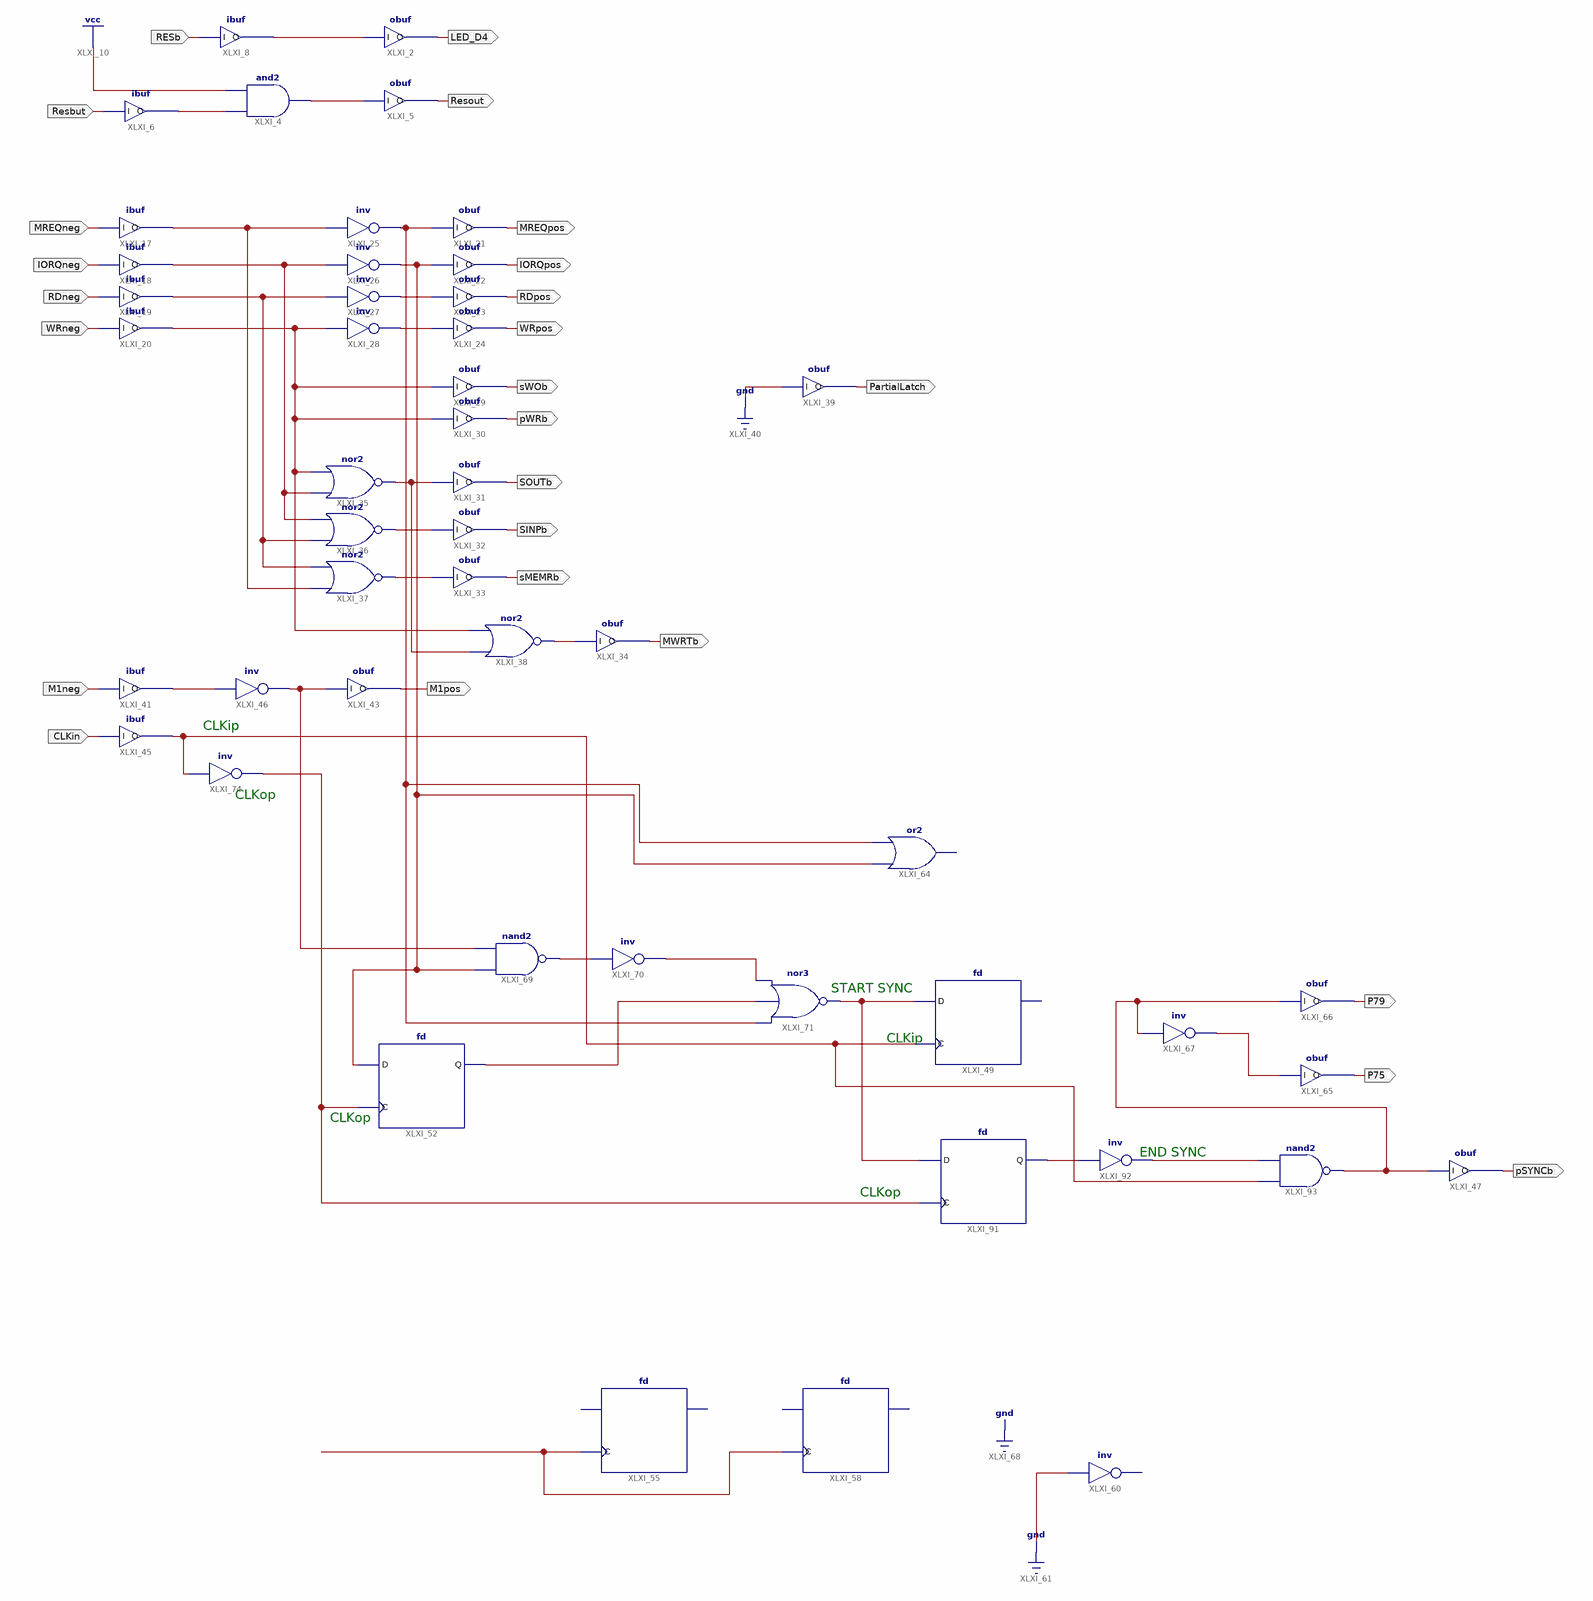
[diagram p0: schematic sheet 1]
// Xilinx ISE schematic IC1v2.sch (xc9500) as structural Verilog: 49 symbols, 25 ports
module IC1v2 (
  input  Resbut,
  input  RESb,
  input  MREQneg,
  input  IORQneg,
  input  RDneg,
  input  WRneg,
  input  M1neg,
  input  CLKin,
  output Resout,
  output LED_D4,
  output MREQpos,
  output IORQpos,
  output RDpos,
  output WRpos,
  output sWOb,
  output pWRb,
  output SOUTb,
  output SINPb,
  output sMEMRb,
  output MWRTb,
  output PartialLatch,
  output M1pos,
  output P75,
  output P79,
  output pSYNCb
);

  wire XLXN_6, XLXN_10, XLXN_13, XLXN_26, XLXN_27, XLXN_40, XLXN_44, XLXN_45, XLXN_46, XLXN_48, XLXN_54,
       XLXN_56, XLXN_58, XLXN_64, XLXN_67, XLXN_75, XLXN_118, XLXN_127, XLXN_129, XLXN_130, XLXN_131,
       XLXN_132, XLXN_133, XLXN_134, XLXN_153, XLXN_155, XLXN_157, XLXN_158;

  and XLXI_4 (XLXN_13, XLXN_6, 1'b1);
  obuf XLXI_5 (.I(XLXN_13), .O(Resout));
  ibuf XLXI_6 (.I(Resbut), .O(XLXN_6));
  obuf XLXI_2 (.I(XLXN_10), .O(LED_D4));
  ibuf XLXI_8 (.I(RESb), .O(XLXN_10));
  ibuf XLXI_17 (.I(MREQneg), .O(XLXN_58));
  ibuf XLXI_18 (.I(IORQneg), .O(XLXN_54));
  ibuf XLXI_19 (.I(RDneg), .O(XLXN_56));
  ibuf XLXI_20 (.I(WRneg), .O(XLXN_40));
  obuf XLXI_21 (.I(XLXN_75), .O(MREQpos));
  obuf XLXI_22 (.I(XLXN_130), .O(IORQpos));
  obuf XLXI_23 (.I(XLXN_26), .O(RDpos));
  obuf XLXI_24 (.I(XLXN_27), .O(WRpos));
  not XLXI_25 (XLXN_75, XLXN_58);
  not XLXI_26 (XLXN_130, XLXN_54);
  not XLXI_27 (XLXN_26, XLXN_56);
  not XLXI_28 (XLXN_27, XLXN_40);
  obuf XLXI_29 (.I(XLXN_40), .O(sWOb));
  obuf XLXI_30 (.I(XLXN_40), .O(pWRb));
  obuf XLXI_31 (.I(XLXN_48), .O(SOUTb));
  obuf XLXI_32 (.I(XLXN_46), .O(SINPb));
  obuf XLXI_33 (.I(XLXN_45), .O(sMEMRb));
  obuf XLXI_34 (.I(XLXN_44), .O(MWRTb));
  nor XLXI_35 (XLXN_48, XLXN_54, XLXN_40);
  nor XLXI_36 (XLXN_46, XLXN_56, XLXN_54);
  nor XLXI_37 (XLXN_45, XLXN_58, XLXN_56);
  nor XLXI_38 (XLXN_44, XLXN_48, XLXN_40);
  obuf XLXI_39 (.I(1'b0), .O(PartialLatch));
  ibuf XLXI_41 (.I(M1neg), .O(XLXN_64));
  obuf XLXI_43 (.I(XLXN_67), .O(M1pos));
  ibuf XLXI_45 (.I(CLKin), .O(XLXN_133));
  not XLXI_46 (XLXN_67, XLXN_64);
  fd XLXI_49 (.C(XLXN_133), .D(XLXN_155));  // open: Q
  fd XLXI_52 (.C(XLXN_131), .D(XLXN_130), .Q(XLXN_134));
  fd XLXI_55 (.C(XLXN_132));  // open: D, Q
  fd XLXI_58 (.C(XLXN_132));  // open: D, Q
  // or2 XLXI_64 has open pins: I0=XLXN_130, I1=XLXN_75, O=open
  nand XLXI_69 (XLXN_127, XLXN_130, XLXN_67);
  not XLXI_70 (XLXN_129, XLXN_127);
  nor XLXI_71 (XLXN_155, XLXN_75, XLXN_134, XLXN_129);
  not XLXI_74 (XLXN_131, XLXN_133);
  // inv XLXI_60 has open pins: I=1'b0, O=open
  obuf XLXI_65 (.I(XLXN_118), .O(P75));
  obuf XLXI_66 (.I(XLXN_153), .O(P79));
  not XLXI_67 (XLXN_118, XLXN_153);
  fd XLXI_91 (.C(XLXN_131), .D(XLXN_155), .Q(XLXN_157));
  not XLXI_92 (XLXN_158, XLXN_157);
  nand XLXI_93 (XLXN_153, XLXN_133, XLXN_158);
  obuf XLXI_47 (.I(XLXN_153), .O(pSYNCb));

  // Notes on the sheet:
  //   CLKip
  //   CLKop
  //   START SYNC
  //   CLKip
  //   CLKop
  //   END SYNC
  //   CLKop
endmodule
